# Altium schematic sheet 0100_STORAGE - M.SchDoc
size A3
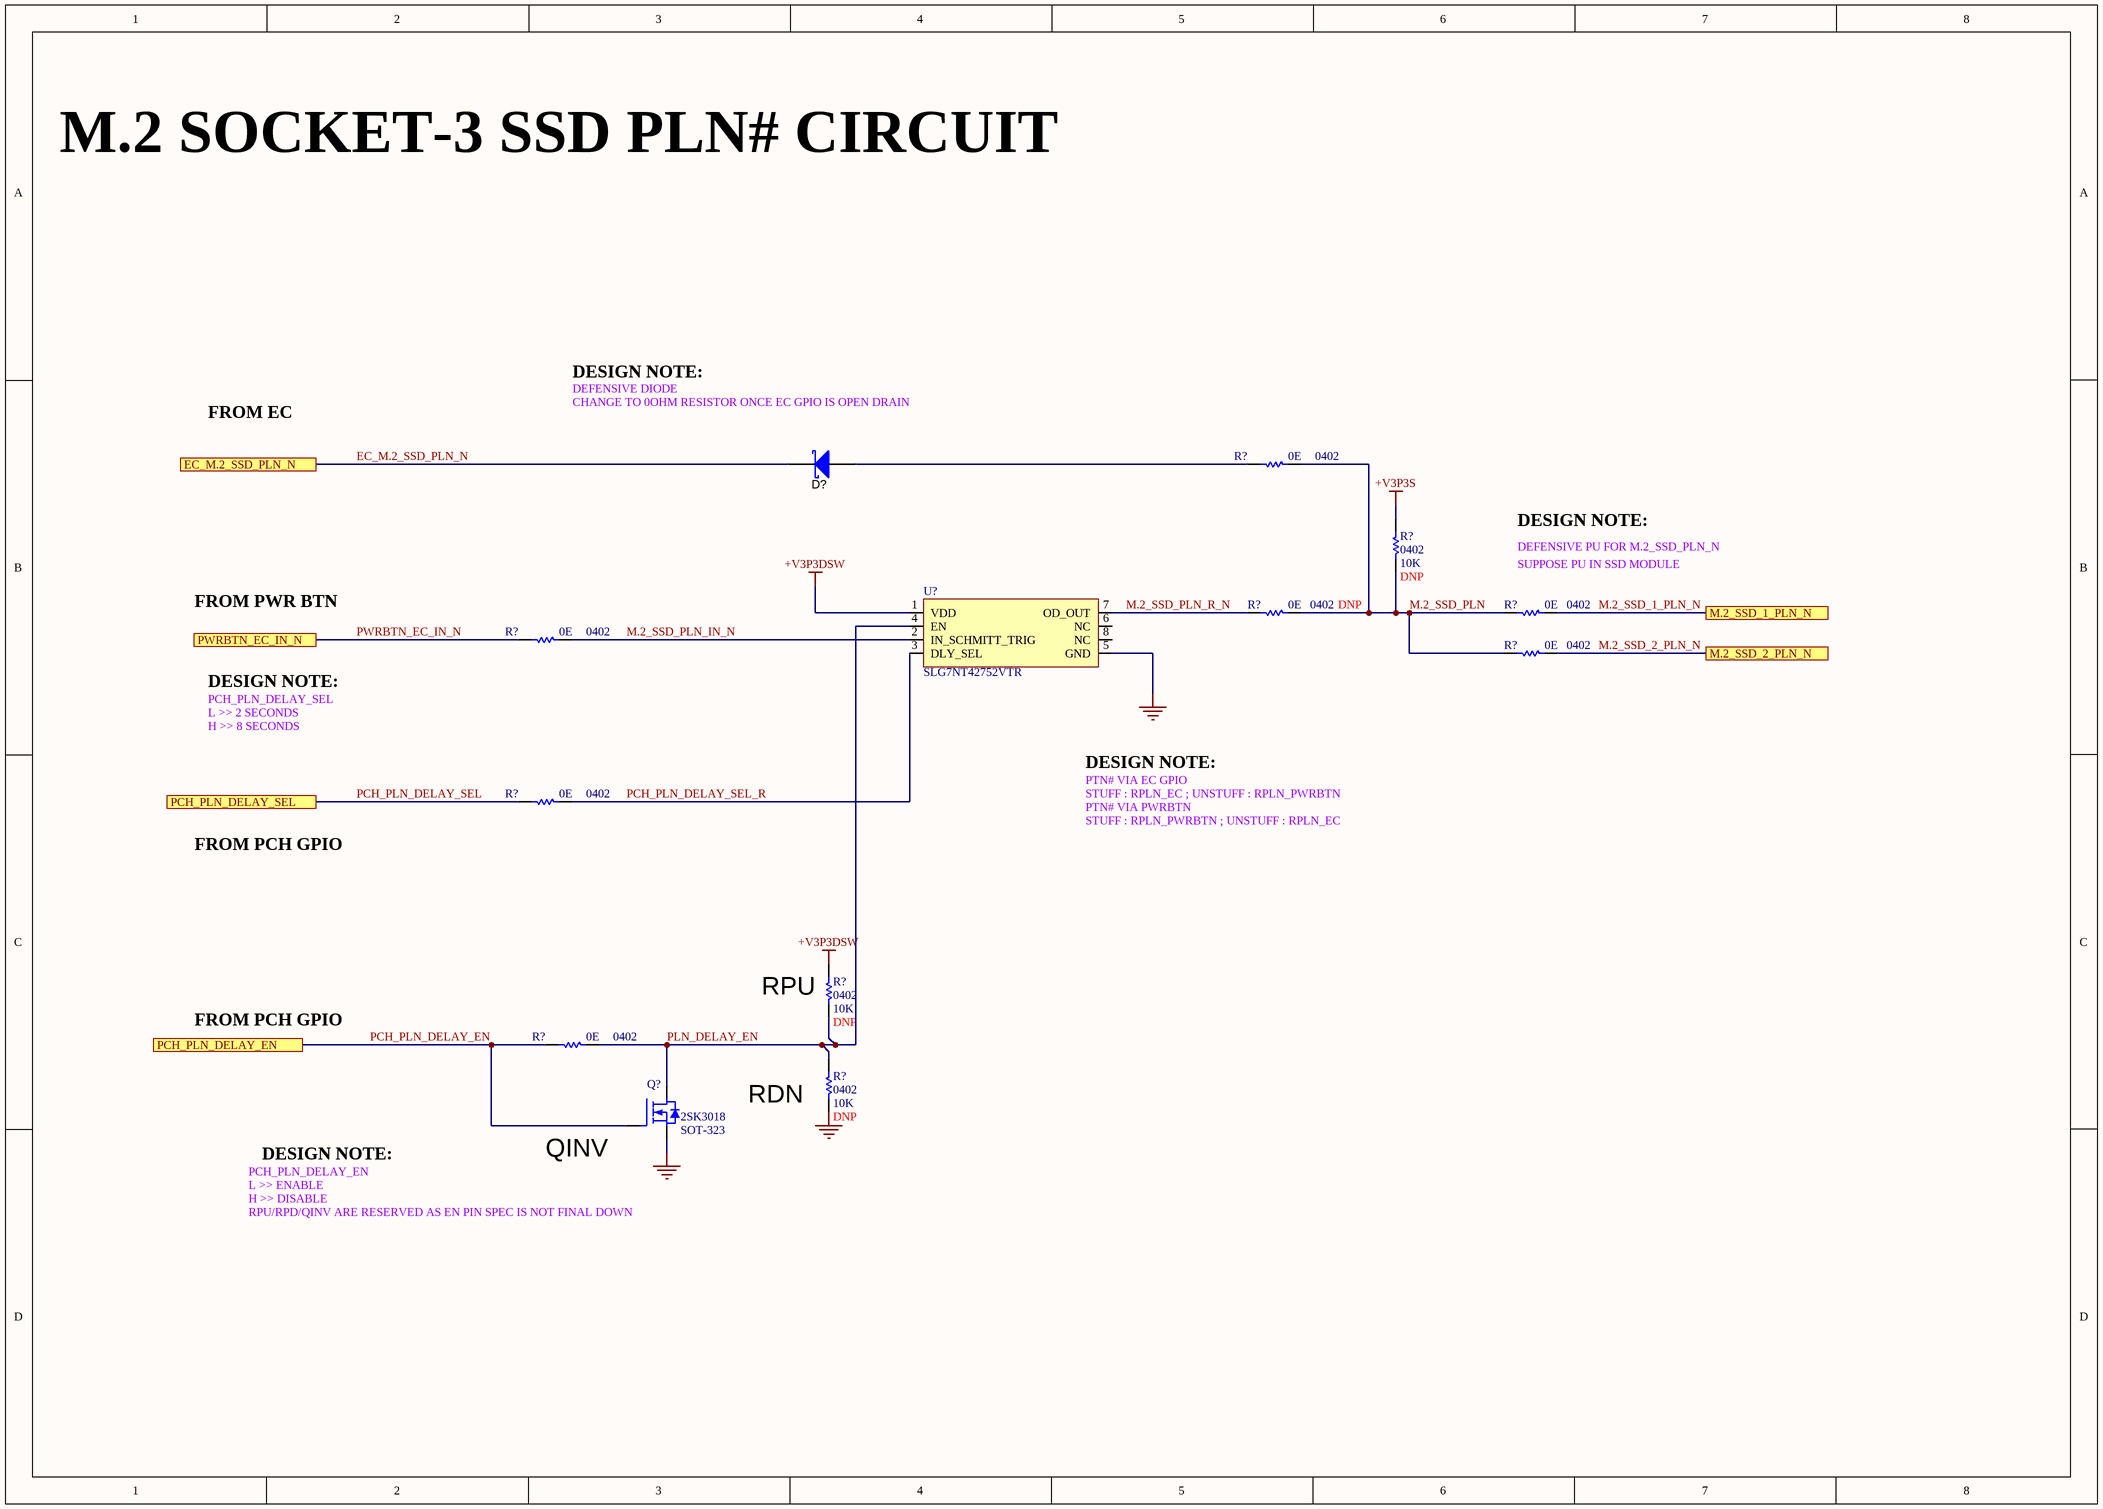
[diagram p0: 0100_STORAGE - M.SchDoc]

## Parts
(Parts that share a designator on the sheet are numbered #1, #2 ... from top to bottom, then left to right.)
D?  SCHOTTKY  (value not drawn)
Q?  Manufacturer Part Number: 2SK3018  Case/Package: SOT-323  [SOT323]  (hidden comment: MOSFET N_2SK3018)
R?#1  value 0E  Case/Package: 0402  [RESC0402]  (hidden comment: Res)
R?#2  value 10K  Case/Package: 0402  [RESC0402]  (hidden comment: Res)
R?#3  value 0E  Case/Package: 0402  [RESC0402]  (hidden comment: Res)
R?#4  value 0E  Case/Package: 0402  [RESC0402]  (hidden comment: Res)
R?#5  value 0E  Case/Package: 0402  [RESC0402]  (hidden comment: Res)
R?#6  value 0E  Case/Package: 0402  [RESC0402]  (hidden comment: Res)
R?#7  value 0E  Case/Package: 0402  [RESC0402]  (hidden comment: Res)
R?#8  value 10K  Case/Package: 0402  [RESC0402]  (hidden comment: Res)
R?#9  value 0E  Case/Package: 0402  [RESC0402]  (hidden comment: Res)
R?#10  value 10K  Case/Package: 0402  [RESC0402]  (hidden comment: Res)
U?  SLG7NT42752VTR

## Ports
EC_M.2_SSD_PLN_N, M.2_SSD_1_PLN_N, M.2_SSD_2_PLN_N, PCH_PLN_DELAY_EN, PCH_PLN_DELAY_SEL, PWRBTN_EC_IN_N

## Nets
+V3P3DSW: R?#8.2 U?.1(VDD)
+V3P3S: R?#2.2
GND: Q?.2(SOURCE) R?#10.1 U?.5(GND)
EC_M.2_SSD_PLN_N: D?.K ; port EC_M.2_SSD_PLN_N
M.2_SSD_1_PLN_N: R?#4.2 ; port M.2_SSD_1_PLN_N
M.2_SSD_2_PLN_N: R?#6.2 ; port M.2_SSD_2_PLN_N
M.2_SSD_PLN: R?#1.2 R?#2.1 R?#3.2 R?#4.1 R?#6.1
M.2_SSD_PLN_IN_N: R?#5.2 U?.2(IN_SCHMITT_TRIG)
M.2_SSD_PLN_R_N: R?#3.1 U?.7(OD_OUT)
PCH_PLN_DELAY_EN: Q?.1(GATE) R?#9.1 ; port PCH_PLN_DELAY_EN
PCH_PLN_DELAY_SEL: R?#7.1 ; port PCH_PLN_DELAY_SEL
PCH_PLN_DELAY_SEL_R: R?#7.2 U?.3(DLY_SEL)
PLN_DELAY_EN: Q?.3(DRAIN) R?#8.1 R?#9.2 R?#10.2 U?.4(EN)
PWRBTN_EC_IN_N: R?#5.1 ; port PWRBTN_EC_IN_N
NetD?_A: D?.A R?#1.1

Not connected (* = marked no-connect by the designer): U? 6(NC) 8(NC)

## Notes on the sheet
- M.2 SOCKET-3 SSD PLN# CIRCUIT
- DESIGN NOTE:
- FROM EC
- CHANGE TO 0OHM RESISTOR ONCE EC GPIO IS OPEN DRAIN
- DEFENSIVE DIODE
- (near R?#4) SUPPOSE PU IN SSD MODULE
- DEFENSIVE PU FOR M.2_SSD_PLN_N
- FROM PWR BTN
- PCH_PLN_DELAY_SEL
- L >> 2 SECONDS
- H >> 8 SECONDS
- PTN# VIA EC GPIO
- FROM PCH GPIO
- STUFF : RPLN_PWRBTN ; UNSTUFF : RPLN_EC
- PTN# VIA PWRBTN
- STUFF : RPLN_EC ; UNSTUFF : RPLN_PWRBTN
- (near R?#8) RPU
- (near R?#10) RDN
- L >> ENABLE
- PCH_PLN_DELAY_EN
- (near Q?) QINV
- RPU/RPD/QINV ARE RESERVED AS EN PIN SPEC IS NOT FINAL DOWN
- H >> DISABLE

## Library data of the parts
D? = SCHOTTKY: Diode, Schottky, 40V, 5A, SMC; ComponentLink1Description: Datasheet link; ComponentLink1URL: http://www.comchip.com.tw/cms/UserFiles/QW-BB012%20CDBC520-G%7E5100-G%20RevC809622.pdf; Manufacturer Part Number: *; Case/Package: *
Q? = MOSFET N_2SK3018: NMOS,2SK3018,SOT_323,Id=0.1A,Vds=30V
R?#1 R?#3-R?#7 R?#9 = Res: Thick Film Resistor -  0ohm, 1%, 0402
  R?#3: DNP: DNP
R?#2 R?#8 R?#10 = Res: Thick Film Resistor -  10Kohm, 1%, 0402; DNP: DNP